# Altium schematic sheet P01-Power.SchDoc
size A3; Date: 2015/11/20; CompanyName: 成都淞幸科技有限责任公司; DrawnBy: 冯光荣; Engineer: 冯光荣; Organization: 系统集成部; Address1: 四川省成都市西航港街道珠江路; Address2: 空港国际城7栋1单元11层; DocumentNumber: SX-ZNJJ-02; Revision: v3.1; SheetNumber: 2; SheetTotal: 6; Telphone: 028-6445 2893; Fax: 028-8580 5757; Website: www.sunsheen.cn; DocumentName: DocumentName; ProjectName: ProjectName
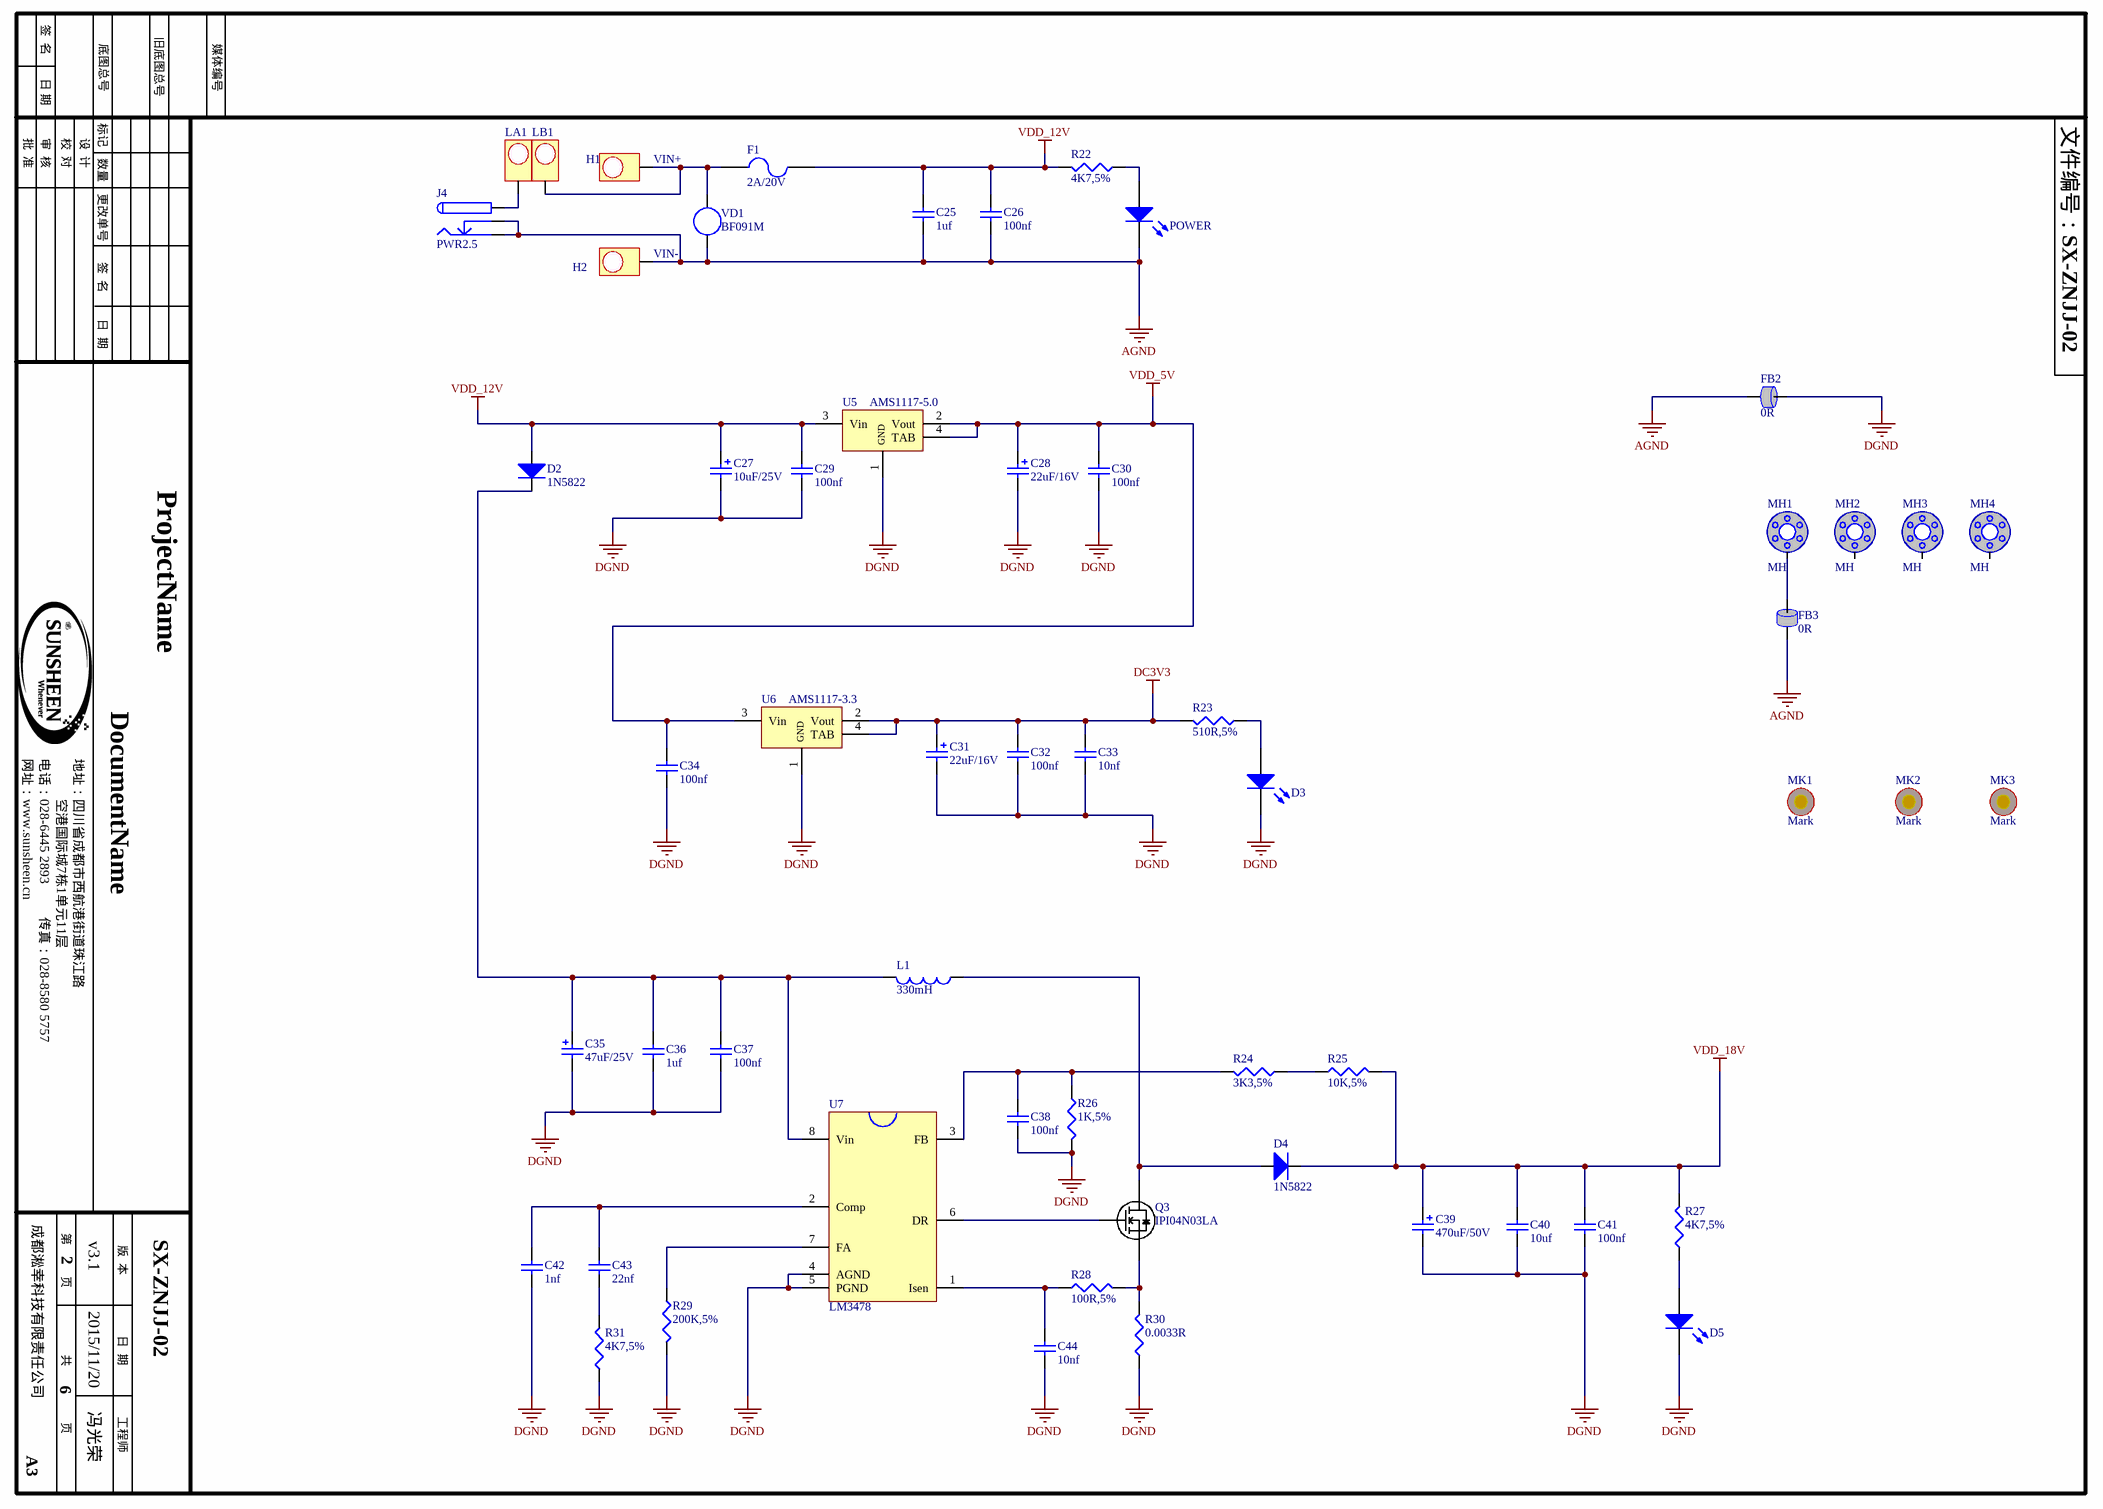
[diagram p0: P01-Power.SchDoc]

## Parts
C25  1uf  [Cap0603]
C26  100nf  [Cap0603]
C27  10uF/25V  [CapPol1_D5]
C28  22uF/16V  [CapPol1_D5]
C29  100nf  [Cap0603]
C30  100nf  [Cap0603]
C31  22uF/16V  [CapPol1_D5]
C32  100nf  [Cap0603]
C33  10nf  [Cap0603]
C34  100nf  [Cap0603]
C35  47uF/25V  [CapPol1_D6]
C36  1uf  [Cap0603]
C37  100nf  [Cap0603]
C38  100nf  [Cap0603]
C39  470uF/50V  [CapPol1_D10]
C40  10uf  [Cap0603]
C41  100nf  [Cap0603]
C42  1nf  [Cap0603]
C43  22nf  [Cap0603]
C44  10nf  [Cap0603]
D2  1N5822  [1N5822]
D3  RED  [LED0603]  (value not drawn)
D4  1N5822  [1N5822]
D5  RED  [LED0603]  (value not drawn)
F1  2A/20V  [1812]
FB2  0R  [FB0603]
FB3  0R  [FB0603]
H1  VIN+  [HOLE_POWER]
H2  VIN-  [HOLE_POWER]
J4  PWR2.5  [KLD-0202]
L1  330mH  [Inductor_12x12x7]
LA1  HOLE_POWER  [HOLE_POWER]  (value not drawn)
LB1  HOLE_POWER  [HOLE_POWER]  (value not drawn)
MH1  MH  [AS_D3mm-6mm]
MH2  MH  [AS_D3mm-6mm]
MH3  MH  [AS_D3mm-6mm]
MH4  MH  [AS_D3mm-6mm]
MK1  Mark  [MK]
MK2  Mark  [MK]
MK3  Mark  [MK]
POWER  RED  [LED0603]  (value not drawn)
Q3  IPI04N03LA  [TO228]
R22  4K7,5%  [Res0603]
R23  510R,5%  [Res0603]
R24  3K3,5%  [Res0603]
R25  10K,5%  [Res0603]
R26  1K,5%  [Res0603]
R27  4K7,5%  [Res0603]
R28  100R,5%  [Res0603]
R29  200K,5%  [Res0603]
R30  0.0033R  [1206A]
R31  4K7,5%  [Res0603]
U5  AMS1117-5.0  [AMS1117]
U6  AMS1117-3.3  [AMS1117]
U7  LM3478  [SOP65P490X110-8N]
VD1  BF091M  [B3D230L]

## Nets
AGND: C25.1 C26.1 FB2.1 FB3.1 H2.1 J4.2 J4.3 POWER.K VD1.2
DC3V3: C31.1 C32.2 C33.2 R23.2 U6.2(Vout) U6.4(TAB)
DGND: C27.2 C28.2 C29.1 C30.1 C31.2 C32.1 C33.1 C34.1 C35.2 C36.1 C37.1 C38.1 C39.2 C40.1 C41.1 C42.1 C44.1 D3.K D5.K FB2.2 R26.2 R29.1 R30.1 R31.1 U5.1(GND) U6.1(GND) U7.4(AGND) U7.5(PGND)
VDD_5V: C28.1 C30.2 C34.2 U5.2(Vout) U5.4(TAB) U6.3(Vin)
VDD_12V: C25.2 C26.2 C27.1 C29.2 D2.A F1.2 R22.2 U5.3(Vin)
VDD_18V: C39.1 C40.2 C41.2 D4.C R25.2 R27.2
NetC35_1: C35.1 C36.2 C37.2 D2.C L1.1 U7.8(Vin)
NetC38_2: C38.2 R24.2 R26.1 U7.3(FB)
NetC42_2: C42.2 C43.2 U7.2(Comp)
NetC43_1: C43.1 R31.2
NetC44_2: C44.2 R28.1 U7.1(Isen)
NetD3_A: D3.A R23.1
NetD4_A: D4.A L1.2 Q3.2(D)
NetD5_A: D5.A R27.1
NetF1_1: F1.1 H1.1 LB1.1 VD1.1
NetFB3_2: FB3.2 MH1.MH1
NetJ4_4: J4.4 LA1.1
NetPOWER_A: POWER.A R22.1
NetQ3_1: Q3.1(G) U7.6(DR)
NetQ3_3: Q3.3(S) R28.2 R30.2
NetR24_1: R24.1 R25.1
NetR29_2: R29.2 U7.7(FA)

Not connected (* = marked no-connect by the designer): MH2 MH1; MH3 MH1; MH4 MH1

## Notes on the sheet
- 签  名
- 底图总号
- 旧底图总号
- 媒体编号
- 日 期
- 批  准
- 审  核
- 校  对
- 设  计
- 标记
- 数量
- 文件编号：
- 更改单号
- 日  期
- 网址：
- 电话：
- 地址：
- 传真：
- 第
- 版  本
- 页
- 共
- A3
- 工程师

## Library data of the parts
C25 C26 C29 C30 C32-C34 C36-C38 C40-C44 = Cap Semi: 无极性电容（表贴）
C27 C28 C31 C35 C39 = Cap Pol1: 极性电容（径向）
D2 D4 = DIODE: 肖基特二极管
D3 D5 POWER = LED: Typical RED, GREEN, YELLOW, AMBER GaAs LED
F1 = Fuse: 保险丝
FB2 FB3 = FerriteBead: 磁珠
H1 H2 LA1 LB1 = HOLE_POWER: 电源接线孔
J4 = PWR2.5: 低电压电源连接器
L1 = Inductor: 电感
MH1-MH4 = MH: 固定孔
MK1-MK3 = Mark: 贴片马克点
Q3 = IPI04N03LA: N沟道MOS管
R22-R31 = Res: 电阻
U5 U6 = AMS1117-3.3: 稳压器
VD1 = B3D230L